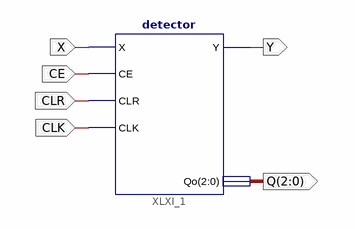
[diagram p0: schematic sheet 1]
// Xilinx ISE schematic schema.sch (xc9500xl) as structural Verilog: 1 symbols, 6 ports
module schema (
  input  X,
  input  CE,
  input  CLR,
  input  CLK,
  output Y,
  output [2:0] Q
);

  detector XLXI_1 (.X(X), .CE(CE), .CLR(CLR), .CLK(CLK), .Y(Y), .Qo(Q));
endmodule
